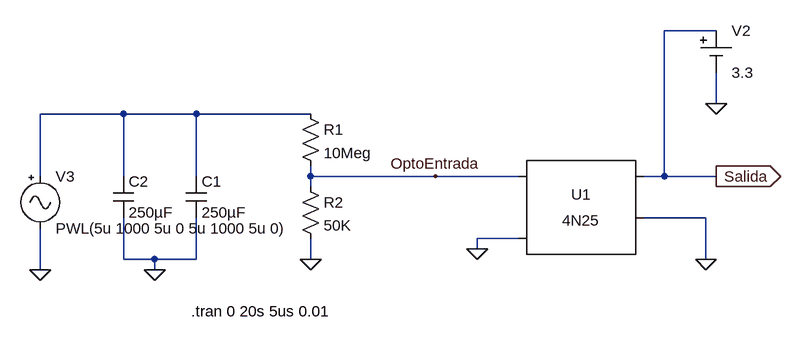
[diagram p0: schematic SensadoTensión.asc]
SensadoTensión.asc, the LTspice schematic file:
Version 4
SHEET 1 880 680
WIRE 640 -80 560 -80
WIRE 640 32 640 -16
WIRE -272 48 -400 48
WIRE -160 48 -272 48
WIRE 16 48 -160 48
WIRE -400 144 -400 48
WIRE -272 144 -272 48
WIRE -160 144 -160 48
WIRE 16 144 16 128
WIRE 208 144 16 144
WIRE 336 144 208 144
WIRE 560 144 560 -80
WIRE 560 144 528 144
WIRE 640 144 560 144
WIRE 16 160 16 144
WIRE 624 208 528 208
WIRE 336 240 272 240
WIRE 272 256 272 240
WIRE -272 272 -272 208
WIRE -224 272 -272 272
WIRE -160 272 -160 208
WIRE -160 272 -224 272
WIRE 16 272 16 240
WIRE 624 272 624 208
WIRE -400 288 -400 224
WIRE -224 288 -224 272
FLAG 16 272 0
FLAG 272 256 0
FLAG 640 144 Salida
IOPIN 640 144 Out
FLAG 208 144 OptoEntrada
FLAG 624 272 0
FLAG 640 32 0
FLAG -224 288 0
FLAG -400 288 0
SYMBOL res 0 32 R0
SYMATTR InstName R1
SYMATTR Value 10Meg
SYMBOL res 0 144 R0
SYMATTR InstName R2
SYMATTR Value 50K
SYMATTR SpiceLine tol=1 pwr=0.1
SYMBOL Optos\\4N25 432 208 R0
SYMATTR InstName U1
SYMBOL Misc\\cell 640 -80 R0
WINDOW 123 0 0 Left 2
WINDOW 39 0 0 Left 2
SYMATTR InstName V2
SYMATTR Value 3.3
SYMBOL cap -176 144 R0
SYMATTR InstName C1
SYMATTR Value 250µF
SYMATTR SpiceLine V=1000V
SYMBOL cap -288 144 R0
SYMATTR InstName C2
SYMATTR Value 250µF
SYMATTR SpiceLine V=1000V
SYMBOL Misc\\signal -400 128 R0
WINDOW 123 0 0 Left 2
WINDOW 39 0 0 Left 2
SYMATTR InstName V3
SYMATTR Value PWL(5u 1000 5u 0 5u 1000 5u 0)
TEXT -168 352 Left 2 !.tran 0 20s 5us 0.01

The netlist it stands for:
* SensadoTensión.asc
R1 N001 OptoEntrada 10Meg
R2 OptoEntrada 0 50K tol=1 pwr=0.1
XU1 OptoEntrada 0 Salida 0 NC_01 4N25
V2 Salida 0 3.3
C1 N001 0 250µF V=1000V
C2 N001 0 250µF V=1000V
V3 N001 0 PWL(5u 1000 5u 0 5u 1000 5u 0)
.tran 0 20s 5us 0.01
.lib 4N25.sub
.backanno
.end